# EAGLE design akabeacon_circle_ble121 (EAGLE 7.2.0)
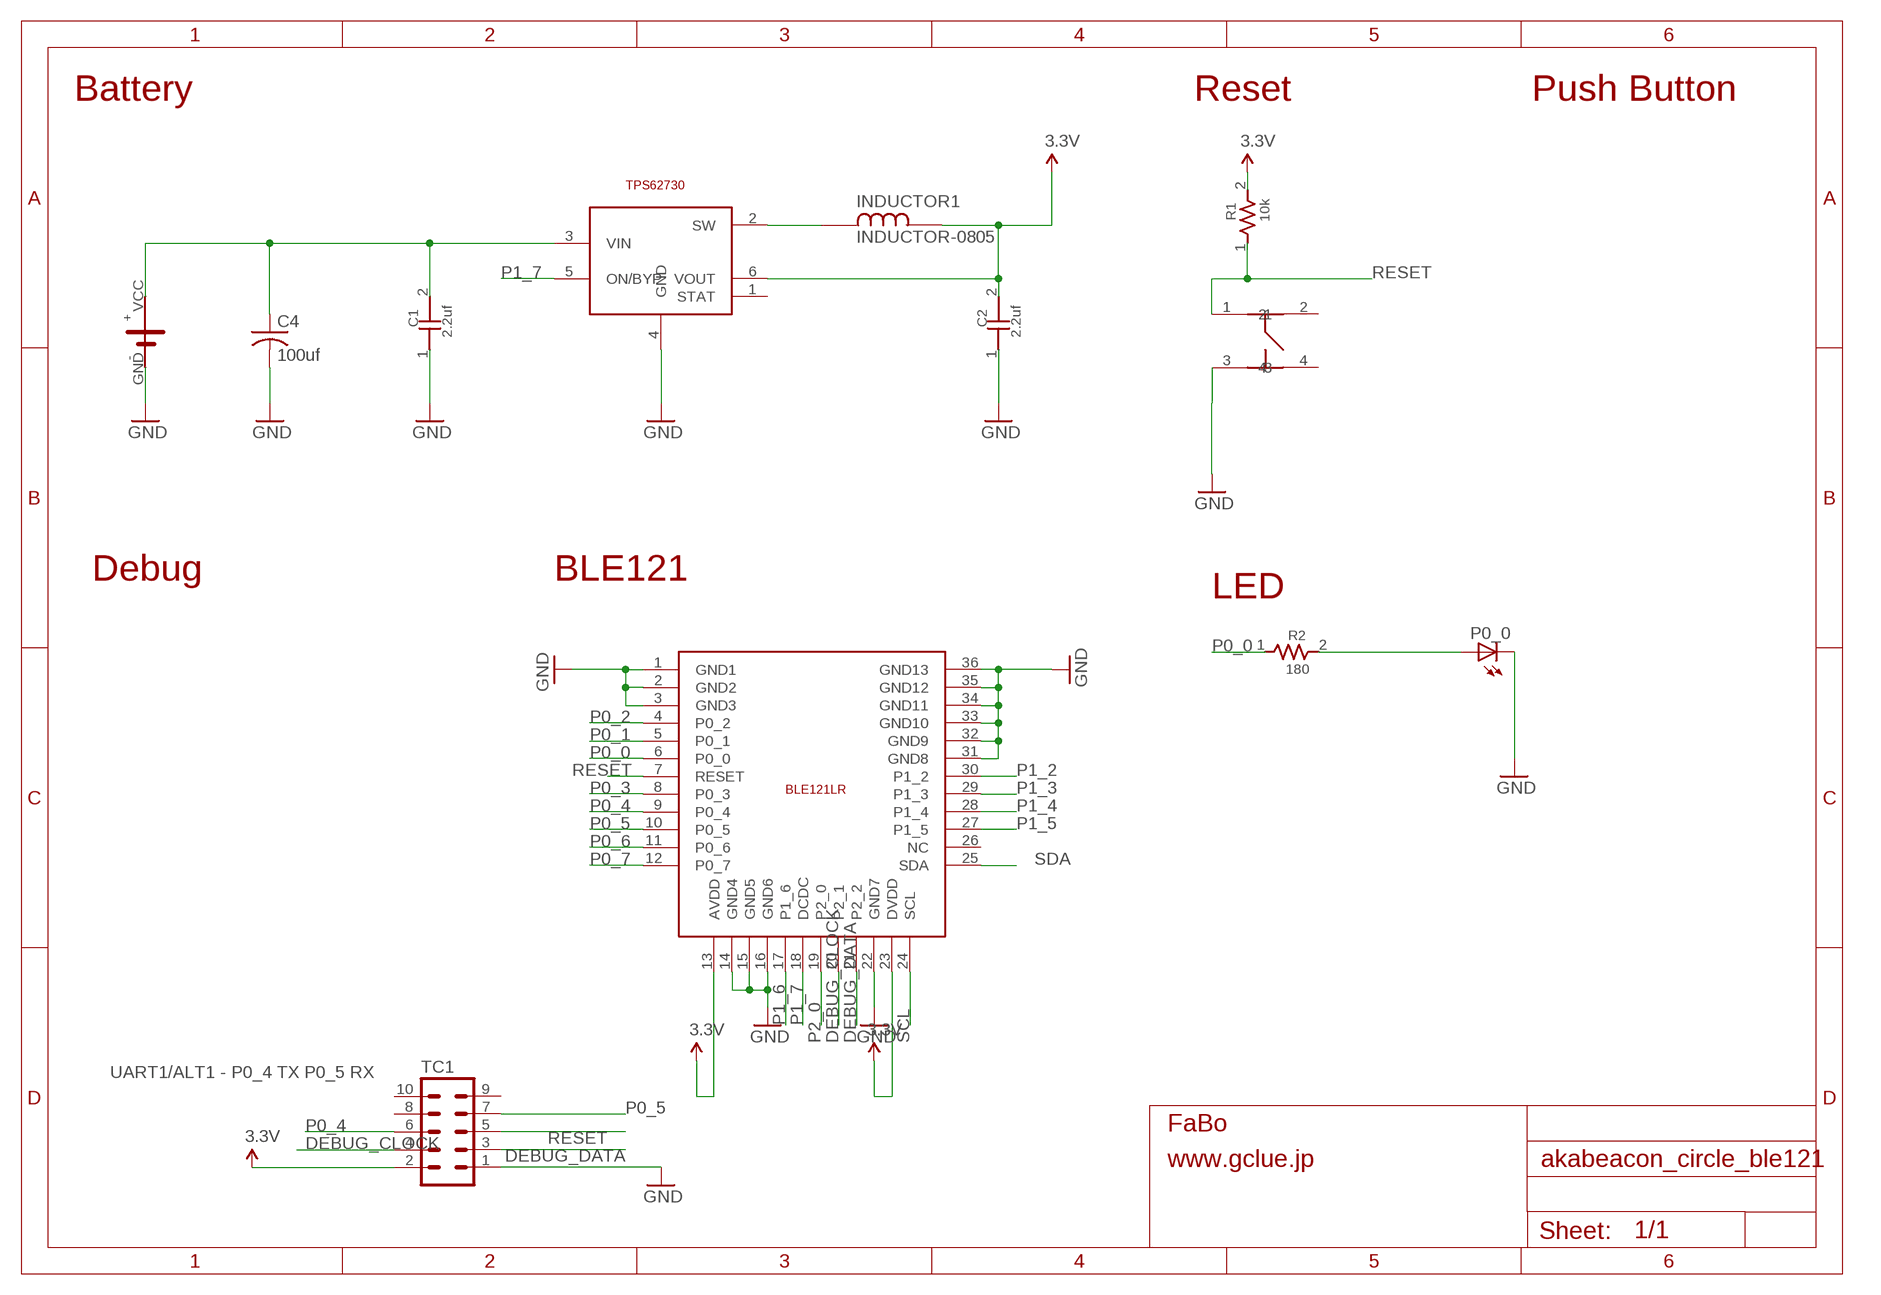
[diagram p0: schematic, sheet 1]

## Parts
BLE1  BLUEGIGA-BLE121LR  [BLUEGIGA-BLE121LR]
C1  2.2uf  CAPACITOR0603  [0603]
C2  2.2uf  CAPACITOR0603  [0603]
C4  100uf  C-USC3225  [C3225]
INDUCTOR1  INDUCTOR-0805  [INDUCTOR-0805]
P0_0  LEDCHIP-LED0603  [CHIP-LED0603]
R1  10k  RESISTOR0603  [0603]
R2  180  RESISTOR0603  [0603]
TC1  TC2050-IDC-NL  [TC2050-IDC-NL]
TPS1  TI-TPS62730  [TI-TPS62730]
U$1  CIRCLE-TYPE1  [CIRCLE-TYE1-TC2030]
U$5  SWICTH-4P(KMR2)  [SWITCH-4P(KMR2)]

## Nets
3.3V: BLE1.13(AVDD) BLE1.23(DVDD) C2.2 INDUCTOR1.P$2 R1.2 TC1.2 TPS1.6(VOUT)
DEBUG_CLOCK: BLE1.20(P2_1) TC1.4
DEBUG_DATA: BLE1.21(P2_2) TC1.3
GND: BLE1.1(GND1) BLE1.2(GND2) BLE1.3(GND3) BLE1.22(GND7) BLE1.31(GND8) BLE1.32(GND9) BLE1.33(GND10) BLE1.34(GND11) BLE1.35(GND12) BLE1.36(GND13) C1.1 C2.1 C4.2 P0_0.C TC1.1 TPS1.4(GND) U$1.GND U$5.3
N$1: C1.2 C4.1 TPS1.3(VIN) U$1.VCC
N$2: P0_0.A R2.2
N$5: INDUCTOR1.P$1 TPS1.2(SW)
N$8: BLE1.14(GND4) BLE1.15(GND5) BLE1.16(GND6) ; supply symbol labelled GND
P0_0: BLE1.6(P0_0) R2.1
P0_1: BLE1.5(P0_1)
P0_2: BLE1.4(P0_2)
P0_3: BLE1.8(P0_3)
P0_4: BLE1.9(P0_4) TC1.6
P0_5: BLE1.10(P0_5) TC1.7
P0_6: BLE1.11(P0_6)
P0_7: BLE1.12(P0_7)
P1_2: BLE1.30(P1_2)
P1_3: BLE1.29(P1_3)
P1_4: BLE1.28(P1_4)
P1_5: BLE1.27(P1_5)
P1_6: BLE1.17(P1_6)
P1_7: BLE1.18(DCDC) TPS1.5(ON/BYP)
P2_0: BLE1.19(P2_0)
RESET: BLE1.7(RESET) R1.1 TC1.5 U$5.1
SCL: BLE1.24(SCL)
SDA: BLE1.25(SDA)
Unconnected: BLE1.26(NC) TC1.8 TC1.9 TC1.10 TPS1.1(STAT) U$5.2 U$5.4

## Notes on the sheet
- Battery | Reset | Push Button
- Debug | BLE121
- LED
- UART1/ALT1 - P0_4 TX P0_5 RX

## Library data of the parts
BLE1 = gclueBT:BLUEGIGA-BLE121LR: Bluetooth Bluetooth 4.0 low energy radio Radio Transmit power: +8 dBm Receiver sensitivity: -98 dBm Typical line-of-sight range: up to 450 meters Current Consumption TX peak current: 36 mA, 25 mA (with DC/DC) RX peak current: 33 mA Power mode 1: 2.7 mA Power mode 2: 1.3 uA Power mode 3: 0.5 uA Certifications Japan: MIC Japan certification ( 209-J00111 )
C1 C2 = GClue-Capacitor:CAPACITOR
C4 = rcl:C-US: CAPACITOR, American symbol
INDUCTOR1 = gclueParts:INDUCTOR-0805
P0_0 = led:LED: LED OSRAM: - CHIPLED LG R971, LG N971, LY N971, LG Q971, LY Q971, LO R971, LY R971 LH N974, LH R974 LS Q976, LO Q976, LY Q976 LO Q996 - Hyper CHIPLED LW Q18S LB Q993, LB Q99A, LB R99A - SideLED LS A670, LO A670, LY A670, LG A670, LP A670 LB A673, LV A673, LT A673, LW A673 LH A674 LY A675 LS A676, LA A676, LO A676, LY A676, LW A676 LS A679, LY A679, LG A679 - Hyper Micro SIDELED® LS Y876, LA Y876, LO Y876, LY Y876 LT Y87S - SmartLED LW L88C, LW L88S LB L89C, LB L89S, LG L890 LS L89K, LO L89K, LY L89K LS L896, LA L896, LO L896, LY L896 - TOPLED LS T670, LO T670, LY T670, LG T670, LP T670 LSG T670, LSP T670, LSY T670, LOP T670, LYG T670 LG T671, LOG T671, LSG T671 LB T673, LV T673, LT T673, LW T673 LH T674 LS T676, LA T676, LO T676, LY T676, LB T676, LH T676, LSB T676, LW T676 LB T67C, LV T67C, LT T67C, LS T67K, LO T67K, LY T67K, LW E67C LS E67B, LA E67B, LO E67B, LY E67B, LB E67C, LV E67C, LT E67C LW T67C LS T679, LY T679, LG T679 LS T770, LO T770, LY T770, LG T770, LP T770 LB T773, LV T773, LT T773, LW T773 LH T774 LS E675, LA E675, LY E675, LS T675 LS T776, LA T776, LO T776, LY T776, LB T776 LHGB T686 LT T68C, LB T68C - Hyper Mini TOPLED® LB M676 - Mini TOPLED Santana® LG M470 LS M47K, LO M47K, LY M47K Source: http://www.osram.convergy.de LUXEON: - LUMILED® LXK2-PW12-R00, LXK2-PW12-S00, LXK2-PW14-U00, LXK2-PW14-V00 LXK2-PM12-R00, LXK2-PM12-S00, LXK2-PM14-U00 LXK2-PE12-Q00, LXK2-PE12-R00, LXK2-PE12-S00, LXK2-PE14-T00, LXK2-PE14-U00 LXK2-PB12-K00, LXK2-PB12-L00, LXK2-PB12-M00, LXK2-PB14-N00, LXK2-PB14-P00, LXK2-PB14-Q00 LXK2-PR12-L00, LXK2-PR12-M00, LXK2-PR14-Q00, LXK2-PR14-R00 LXK2-PD12-Q00, LXK2-PD12-R00, LXK2-PD12-S00 LXK2-PH12-R00, LXK2-PH12-S00 LXK2-PL12-P00, LXK2-PL12-Q00, LXK2-PL12-R00 Source: www.luxeon.com KINGBRIGHT: KA-3528ASYC Source: www.kingbright.com
R1 R2 = GClue-Resistors:RESISTOR
TC1 = TagConnect:TC2050-IDC: Tag-Connect In Circuit Programming & Debug Cable 10 Pin http://www.tag-connect.com
TPS1 = gclueSupply:TI-TPS62730
U$1 = GClue-Beacon:CIRCLE-TYPE1
U$5 = gclue-test:SWICTH-4P(KMR2)

## Board
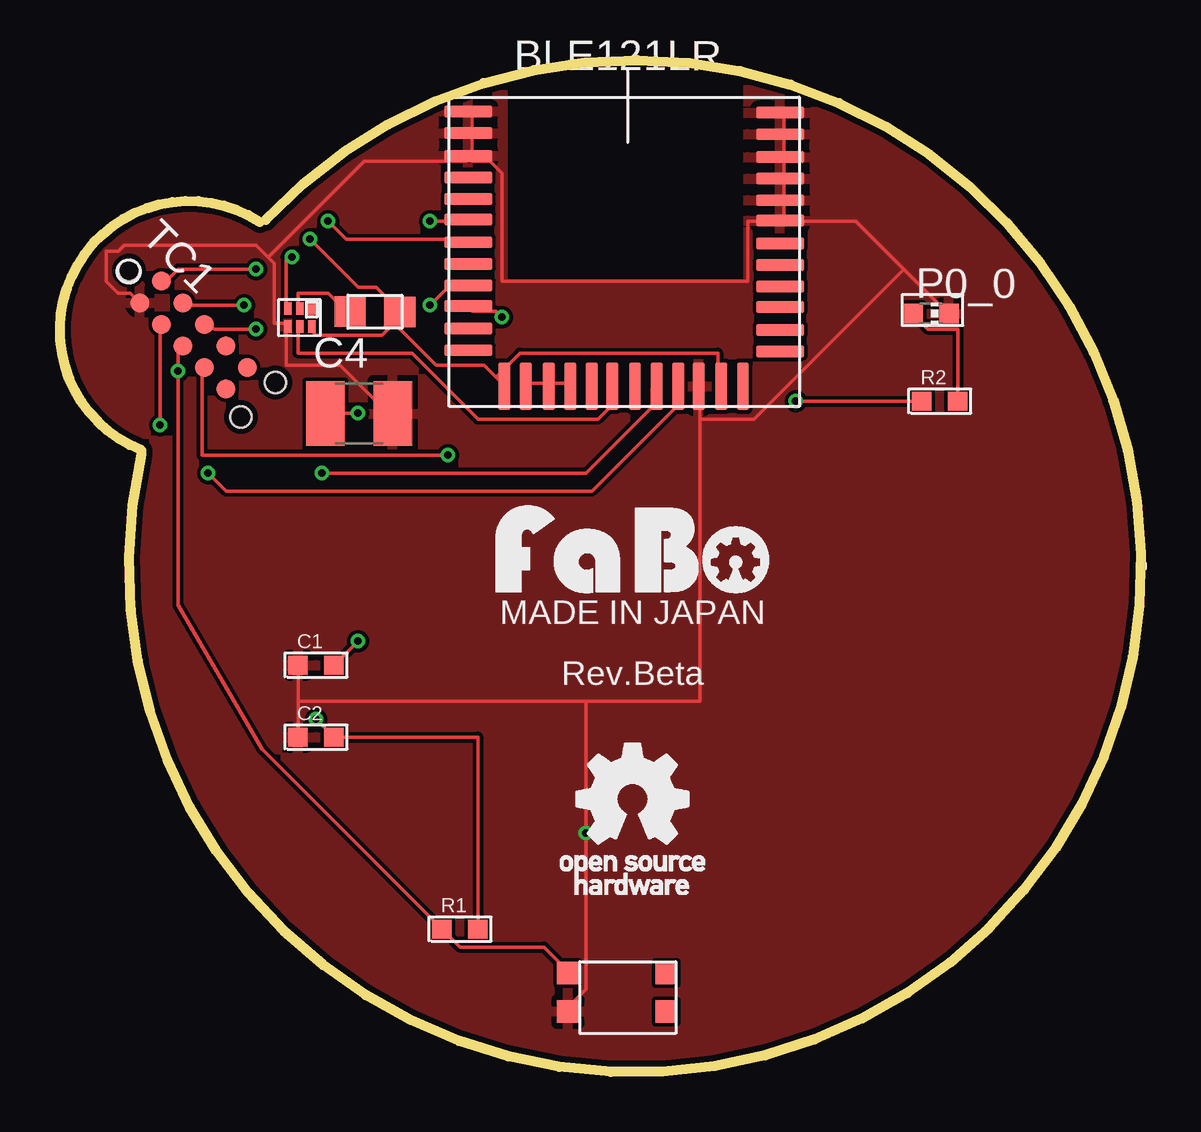
[diagram p1: board, top side]
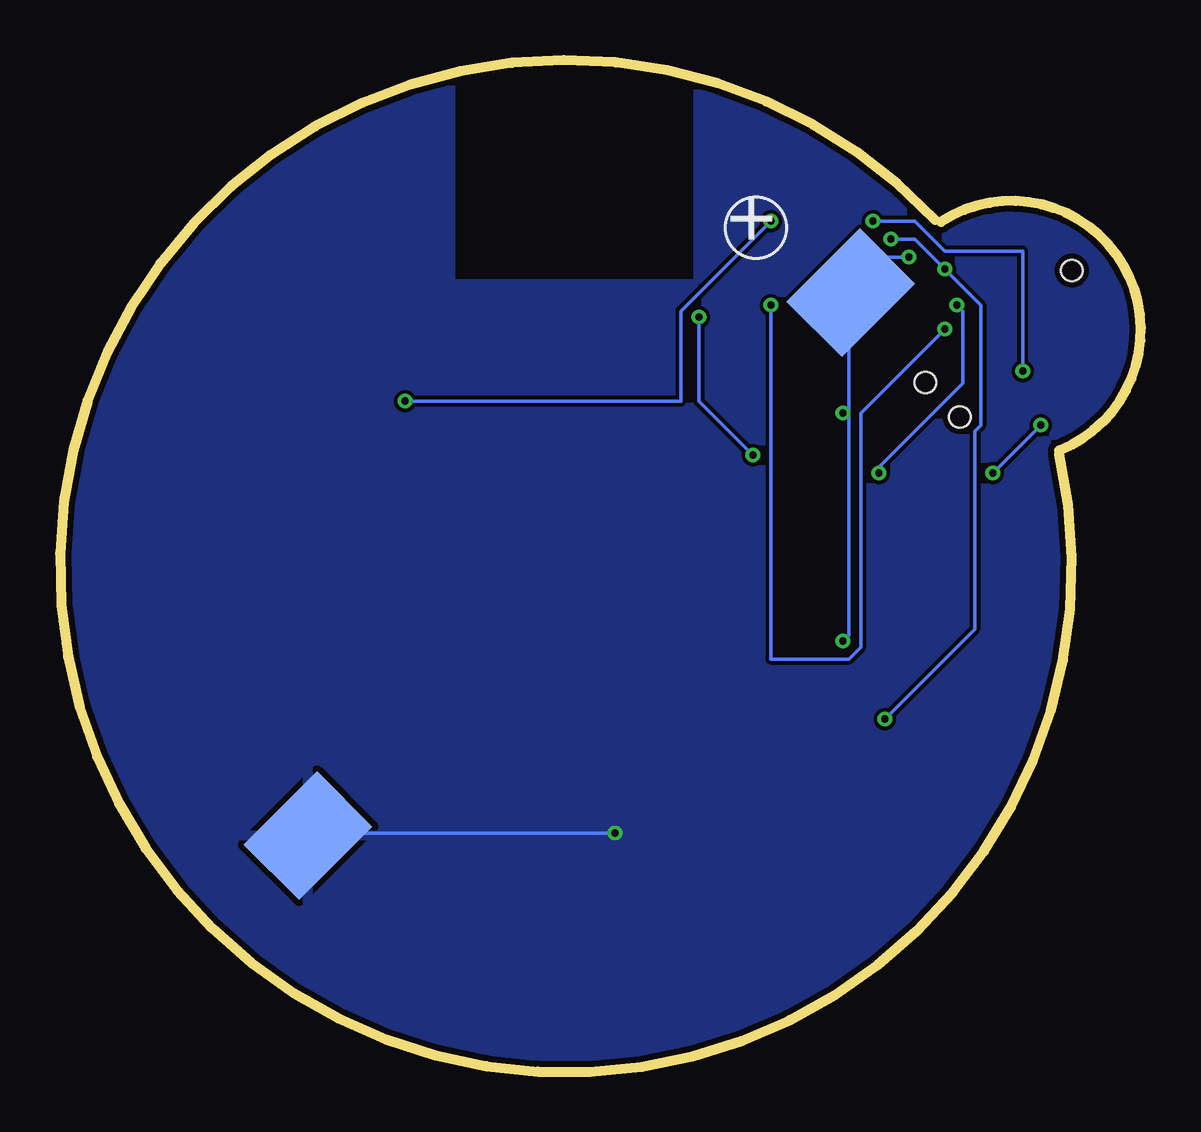
[diagram p2: board, bottom side, seen from below]

Size 45.05 x 42.16 mm. Coordinates in mm from the lower left corner, seen from the top.
Copper layers (1*16): Top 0.035mm / dielectric 1.5mm / Bottom 0.035mm
Design rules "SeeedStudio_2layer_DRU_no_angle_20140221": minimum track width 6mil, minimum drill 12mil, track to track 6mil, track to pad 6mil, pad to pad 6mil, via to via 6mil, smd to smd 0mil, copper to edge 10mil, drill to drill 10mil, minimum pad ring 10mil, minimum via ring 6mil, stop-mask expansion 2mil, vias tented up to drill 100mil, thermal gap 10mil
tRestrict: area 18.7,33 to 28.5,42.5
bRestrict: area 18.7,33 to 28.6,42.6

### Footprints (pad centres in the part's own frame; a part is rotated, then mirrored left to right if it is on the bottom)
BLUEGIGA-BLE121LR = smd 2 x 0.5: 1 -6.4,4.8; 2 -6.4,3.9; 3 -6.4,2.95; 4 -6.4,2.05; 5 -6.4,1.15; 6 -6.4,0.3; 7 -6.4,-0.65; 8 -6.4,-1.55; 9 -6.4,-2.45; 10 -6.4,-3.3; 11 -6.4,-4.25; 12 -6.4,-5.15; 25 6.6,-5.2; 26 6.6,-4.3; 27 6.6,-3.35; 28 6.6,-2.5; 29 6.6,-1.6; 30 6.6,-0.7; 31 6.6,0.25; 32 6.6,1.1; 33 6.6,2; 34 6.6,2.9; 35 6.6,3.85; 36 6.6,4.75 | smd 0.5 x 2: 13 -4.9,-6.65; 14 -4,-6.65; 15 -3.05,-6.65; 16 -2.15,-6.65; 17 -1.25,-6.65; 18 -0.4,-6.65; 19 0.55,-6.65; 20 1.45,-6.65; 21 2.35,-6.65; 22 3.2,-6.65; 23 4.15,-6.65; 24 5.05,-6.65
0603 = smd 0.8 x 0.8: 1 -0.75,0; 2 0.75,0
C3225 = smd 1.6 x 2.7: 1 -1.4,0; 2 1.4,0
INDUCTOR-0805 = smd 1.3 x 1.27: P$1 -1.04,0.02; P$2 1.04,0.01
CHIP-LED0603 = smd 0.8 x 0.8: A 0,-0.75; C 0,0.75
TC2050-IDC-NL = smd 0.787 x 0.787: 1 -2.54,-0.635; 2 -2.54,0.635; 3 -1.27,-0.635; 4 -1.27,0.635; 5 0,-0.635; 6 0,0.635; 7 1.27,-0.635; 8 1.27,0.635; 9 2.54,-0.635; 10 2.54,0.635 | hole 0.889: -3.81,0; 3.81,-1.016; 3.81,1.016
TI-TPS62730 = smd 0.3 x 0.52: 1 0.48,0.25; 2 -0.02,0.25; 3 -0.52,0.25; 4 -0.52,-0.5; 5 -0.02,-0.5; 6 0.48,-0.5
CIRCLE-TYE1-TC2030 = smd 4.318 x 3.251 rotated 135 bottom: GND 11.046,-11.107; VCC -11.581,11.521
SWITCH-4P(KMR2) = smd 0.9 x 0.95: 1 -1,0; 2 3.1,0; 3 -1,-1.6; 4 3.1,-1.6

### Placement (x,y rotation side)
BLE1  23.42,35.22 0 top
C1  10.67,16.95 0 top
C2  10.67,13.95 0 top
C4  12.47,27.43 0 top
INDUCTOR1  13.13,31.66 0 top
P0_0  36.31,31.6 270 top
R1  16.67,5.95 0 top
R2  36.67,27.95 0 top
TC1  TC2050-IDC  [TC2050-IDC-NL]  5.57,30.7 315 top
TPS1  10.02,31.56 0 top
U$1  23.67,20.95 0 top
U$2  [LOGO_FABO_M]  23.87,19.95 0 top
U$4  [LOGO_OSHW_T_M]  23.87,11.35 0 top
U$5  22.17,4.12 0 top

### Tracks (layer width: path | path; a pad name or v marks a point on that pad's centre or on a via)
3.3V  (via drill 0.3)
  Top 0.152: R1.2 17.42,13.95 C2.2 v10.67,14.7 | 13.92,31.2 14.17,31.45 INDUCTOR1.P$2 | 13.92,31.2 13.42,30.7 10.67,30.7 10.42,30.95 TPS1.6 | v8.17,33.45 4.92,33.45 4.42,32.95 TC1.2 | v10.42,34.7 12.42,32.7 13.17,32.7 14.17,31.7 INDUCTOR1.P$2 | 18.17,28.95 17.67,29.45 15.67,29.45 13.92,31.2 | 18.17,28.95 18.42,28.7 BLE1.13 | 13.92,31.2 INDUCTOR1.P$2 | 18.17,28.95 19.17,29.95 27.42,29.95 27.42,28.7 BLE1.23
  Bottom 0.152: v10.42,34.7 9.42,34.7 v8.17,33.45 6.67,31.95 6.67,26.95 6.92,26.7 6.92,18.45 v10.67,14.7
DEBUG_CLOCK  (via drill 0.3)
  Top 0.152: v7.67,31.95 5.42,31.95 5.17,32.2 TC1.4 | v10.92,24.95 21.92,24.95 24.67,27.7 24.67,28.45 BLE1.20
  Bottom 0.152: v7.67,31.95 7.42,31.7 7.42,28.7 10.92,25.2 v10.92,24.95
DEBUG_DATA  (via drill 0.3)
  Top 0.152: v4.17,26.95 4.17,30.95 TC1.3 | v6.17,24.95 6.92,24.2 22.17,24.2 25.67,27.7 25.67,28.45 BLE1.21
  Bottom 0.152: v6.17,24.95 v4.17,26.95
GND  (via drill 0.3)
  Top 0.152: BLE1.3 17.17,38.2 17.17,38.95 BLE1.2 17.17,39.2 17.17,39.95 BLE1.1 | C4.2 13.67,27.45 11.67,29.45 9.42,29.45 9.42,30.95 TPS1.4 9.42,31.2 8.92,31.2 8.92,33.7 8.67,33.95 | 8.67,33.95 8.17,34.45 2.67,34.45 2.42,34.2 1.92,34.2 1.92,32.95 2.42,32.45 2.92,32.45 3.17,32.2 TC1.1 | 8.67,33.95 12.67,37.95 16.92,37.95 BLE1.3 | BLE1.36 30.17,39.95 30.17,39.2 BLE1.35 30.17,38.95 30.17,38.2 BLE1.34 30.17,37.95 30.17,37.45 BLE1.33 30.17,37.2 30.17,36.45 BLE1.32 30.17,36.2 30.17,35.7 BLE1.31 | 35.17,33.45 33.17,35.45 30.17,35.45 BLE1.31 | 35.17,33.45 36.92,31.7 P0_0.C | 26.67,27.2 26.67,28.45 BLE1.22 | 26.67,27.2 28.92,27.2 35.17,33.45 | C1.1 9.92,15.45 | 9.92,15.45 C2.1 | 21.92,15.45 v21.92,9.95 21.92,3.45 21.17,2.7 U$5.3 | 9.92,15.45 21.92,15.45 | 26.67,27.2 26.67,15.45 21.92,15.45 | BLE1.3 17.17,37.95 17.92,37.95 18.42,37.45 18.42,32.95 28.67,32.95 28.67,35.45 29.92,35.45 BLE1.31
  Bottom 0.152: v21.92,9.95 34.67,9.95 U$1.GND
  pour Top: -0.33,-0.05 45.67,-0.05 45.67,42.95 -0.33,42.95
  pour Bottom: -0.33,-0.05 45.67,-0.05 45.67,42.95 -0.33,42.95
N$1  (via drill 0.3)
  Top 0.152: v9.67,33.95 9.42,33.95 9.42,31.95 TPS1.3 | v12.42,17.95 C1.2 | v12.42,27.45 11.17,27.45 C4.1
  Bottom 0.152: v9.67,33.95 11.92,33.95 11.92,32.7 U$1.VCC 12.17,32.45 12.17,27.45 | v12.42,17.95 12.17,18.2 12.17,27.45 | 12.17,27.45 v12.42,27.45
N$2
  Top 0.152: R2.2 37.42,30.95 36.17,30.95 35.67,31.45 P0_0.A
N$5
  Top 0.152: TPS1.2 9.92,31.95 9.92,32.45 11.17,32.45 11.92,31.7 INDUCTOR1.P$1
N$8
  Top 0.152: BLE1.14 19.42,28.7 20.17,28.7 BLE1.15 20.42,28.7 21.17,28.7 BLE1.16
P0_0  (via drill 0.3)
  Top 0.152: v30.67,27.95 R2.1 | v15.42,35.45 16.92,35.45 BLE1.6
  Bottom 0.152: v30.67,27.95 19.17,27.95 19.17,31.7 v15.42,35.45
P0_4  (via drill 0.3)
  Top 0.152: v8.17,30.95 6.42,30.95 6.17,31.2 TC1.6 | v15.42,31.95 16.17,32.7 16.92,32.7 BLE1.9
  Bottom 0.152: v8.17,30.95 11.67,27.45 11.67,17.7 12.17,17.2 15.42,17.2 v15.42,31.95
P0_5  (via drill 0.3)
  Top 0.152: v16.17,25.7 5.92,25.7 5.92,29.2 TC1.7 | v18.42,31.45 18.17,31.7 17.17,31.7 BLE1.10
  Bottom 0.152: v16.17,25.7 18.42,27.95 v18.42,31.45
P1_7
  Top 0.152: TPS1.5 9.92,30.95 9.92,29.95 14.67,29.95 17.42,27.2 22.42,27.2 22.92,27.7 22.92,28.45 BLE1.18
RESET  (via drill 0.3)
  Top 0.152: TC1.5 4.92,30.2 v4.92,29.2 4.92,19.45 8.42,13.45 R1.1 16.67,5.2 20.17,5.2 21.17,4.2 U$5.1 | v11.17,35.45 11.92,34.7 16.92,34.7 BLE1.7
  Bottom 0.152: v11.17,35.45 9.42,35.45 8.17,34.2 4.92,34.2 v4.92,29.2

### Text on the board
tPlace: MADE IN JAPAN | Rev.Beta